# EAGLE design Dialer (EAGLE 7.2.0)
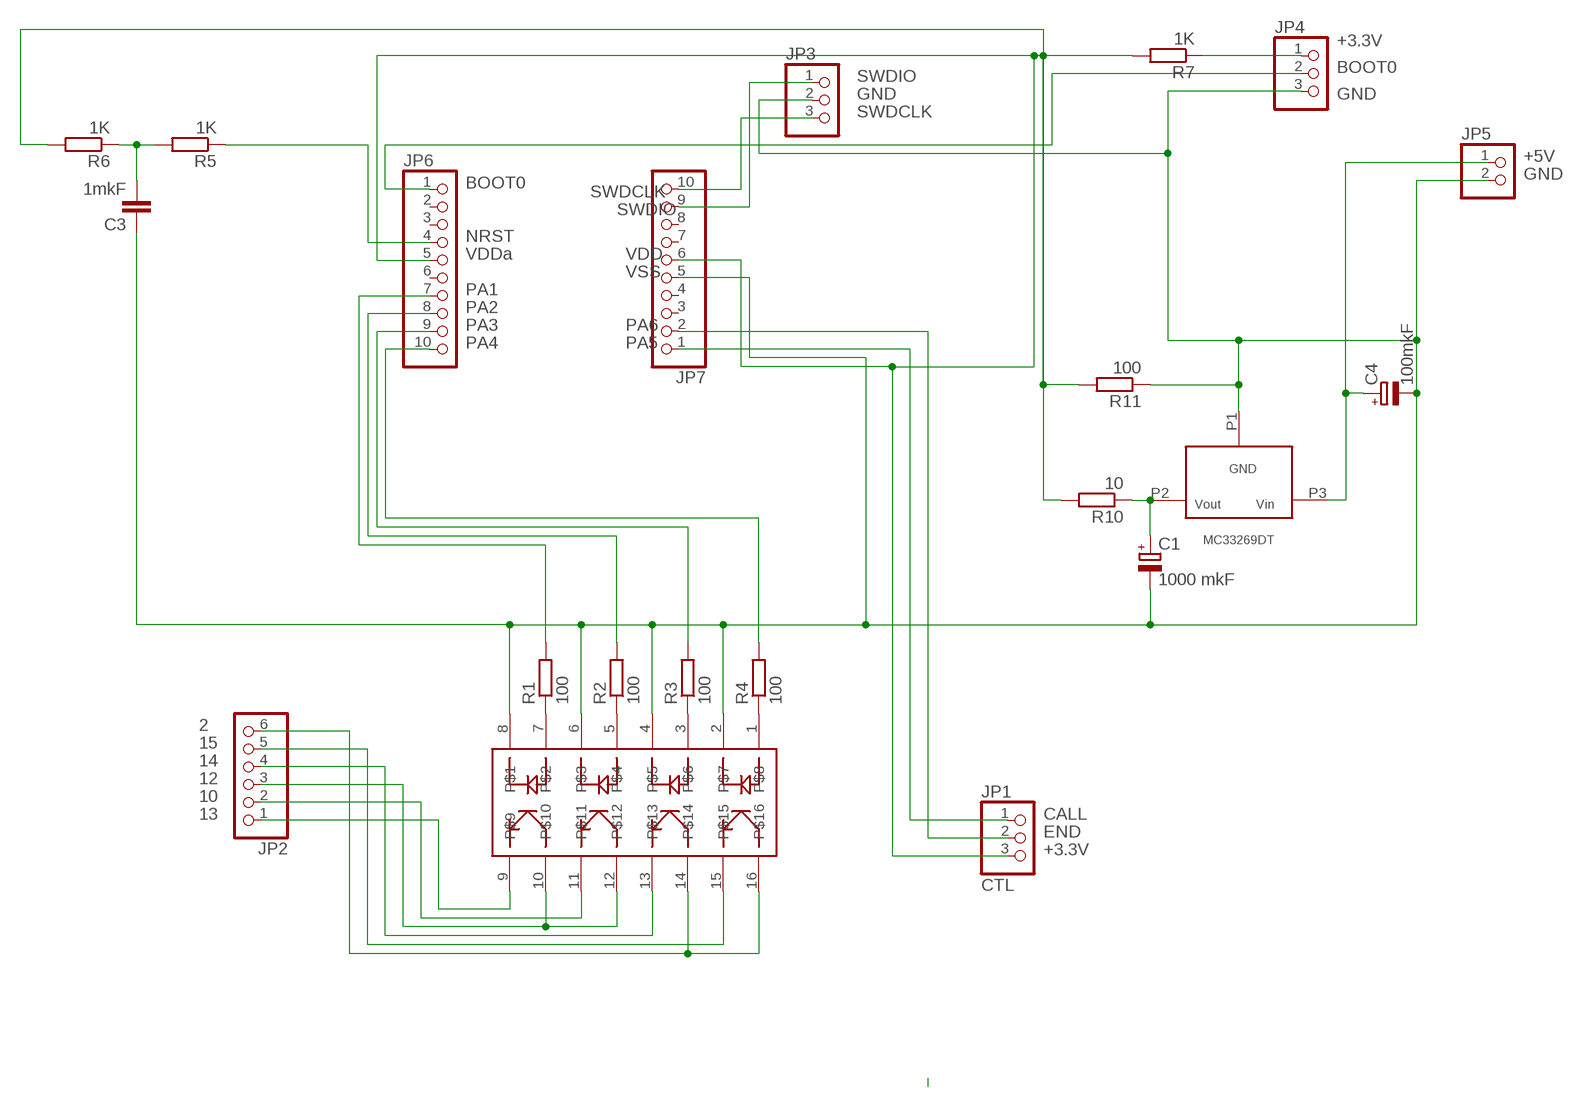
[diagram p0: schematic, sheet 1]

## Parts
C1  1000 mkF  CPOL-EUE3.5-8  [E3,5-8]
C3  1mkF  C-EUC1206  [C1206]
C4  100mkF  CPOL-EUE5-6  [E5-6]
JP1  CTL  PINHD-1X3  [1X03]
JP2  PINHD-1X6  [1X06]
JP3  PINHD-1X3  [1X03]
JP4  PINHD-1X3  [1X03]
JP5  PINHD-1X2  [1X02]
JP6  PINHD-1X10  [1X10]
JP7  PINHD-1X10  [1X10]
R1  100  R-EU_M1206  [M1206]
R2  100  R-EU_M1206  [M1206]
R3  100  R-EU_M1206  [M1206]
R4  100  R-EU_M1206  [M1206]
R5  1K  R-EU_M1206  [M1206]
R6  1K  R-EU_M1206  [M1206]
R7  1K  R-EU_M1206  [M1206]
R10  10  R-EU_M1206  [M1206]
R11  100  R-EU_M1206  [M1206]
U$1  LTV847  [DIL16]
U$3  MC33269DT  [MC33269DT]

## Nets
N$1: JP3.3 JP7.10
N$2: JP6.10 R4.2
N$3: JP6.7 R1.2
N$4: JP6.8 R2.2
N$5: JP6.9 R3.2
N$6: JP3.1 JP7.9
N$7: JP2.6 U$1.14 U$1.16
N$8: JP2.5 U$1.15
N$9: JP2.4 U$1.13
N$10: JP2.3 U$1.10 U$1.12
N$11: JP2.2 U$1.11
N$12: JP2.1 U$1.9
N$13: C1.- C3.1 C4.- JP3.2 JP4.3 JP5.2 JP7.5 R11.1 U$1.2 U$1.4 U$1.6 U$1.8 U$3.P1(GND)
N$14: C4.+ JP5.1 U$3.P3(VIN)
N$15: JP1.3 JP6.5 JP7.6 R6.2 R7.2 R10.2 R11.2
N$18: R1.1 U$1.7
N$19: R2.1 U$1.5
N$20: R3.1 U$1.3
N$21: R4.1 U$1.1
N$70: JP1.1 JP7.1
N$71: JP1.2 JP7.2
N$72: JP6.4 R5.1
N$73: C3.2 R5.2 R6.1
N$74: C1.+ R10.1 U$3.P2(VOUT)
N$75: JP4.1 R7.1
N$76: JP4.2 JP6.1
Unconnected: JP6.2 JP6.3 JP6.6 JP7.3 JP7.4 JP7.7 JP7.8

## Notes on the sheet
- +3.3V
- BOOT0
- SWDIO
- GND | GND
- SWDCLK
- +5V
- GND
- BOOT0
- SWDCLK
- SWDIO
- NRST
- VDDa | VDD
- VSS
- PA1
- PA2
- PA3 | PA6
- PA4 | PA5
- 2
- 15
- 14
- 12
- 10
- 13 | CALL
- END
- +3.3V

## Library data of the parts
C1 C4 = resistor:CPOL-EU: POLARIZED CAPACITOR, European symbol
C3 = resistor:C-EU: CAPACITOR, European symbol
JP1 JP3 JP4 = pinhead:PINHD-1X3: PIN HEADER
JP2 = pinhead:PINHD-1X6: PIN HEADER
JP5 = pinhead:PINHD-1X2: PIN HEADER
JP6 JP7 = pinhead:PINHD-1X10: PIN HEADER
R1-R7 R10 R11 = resistor:R-EU_: RESISTOR, European symbol
U$1 = optocoupler:LTV847: LTV847 4-optocoupler DIP16
U$3 = mc33269dt:MC33269DT

## Board
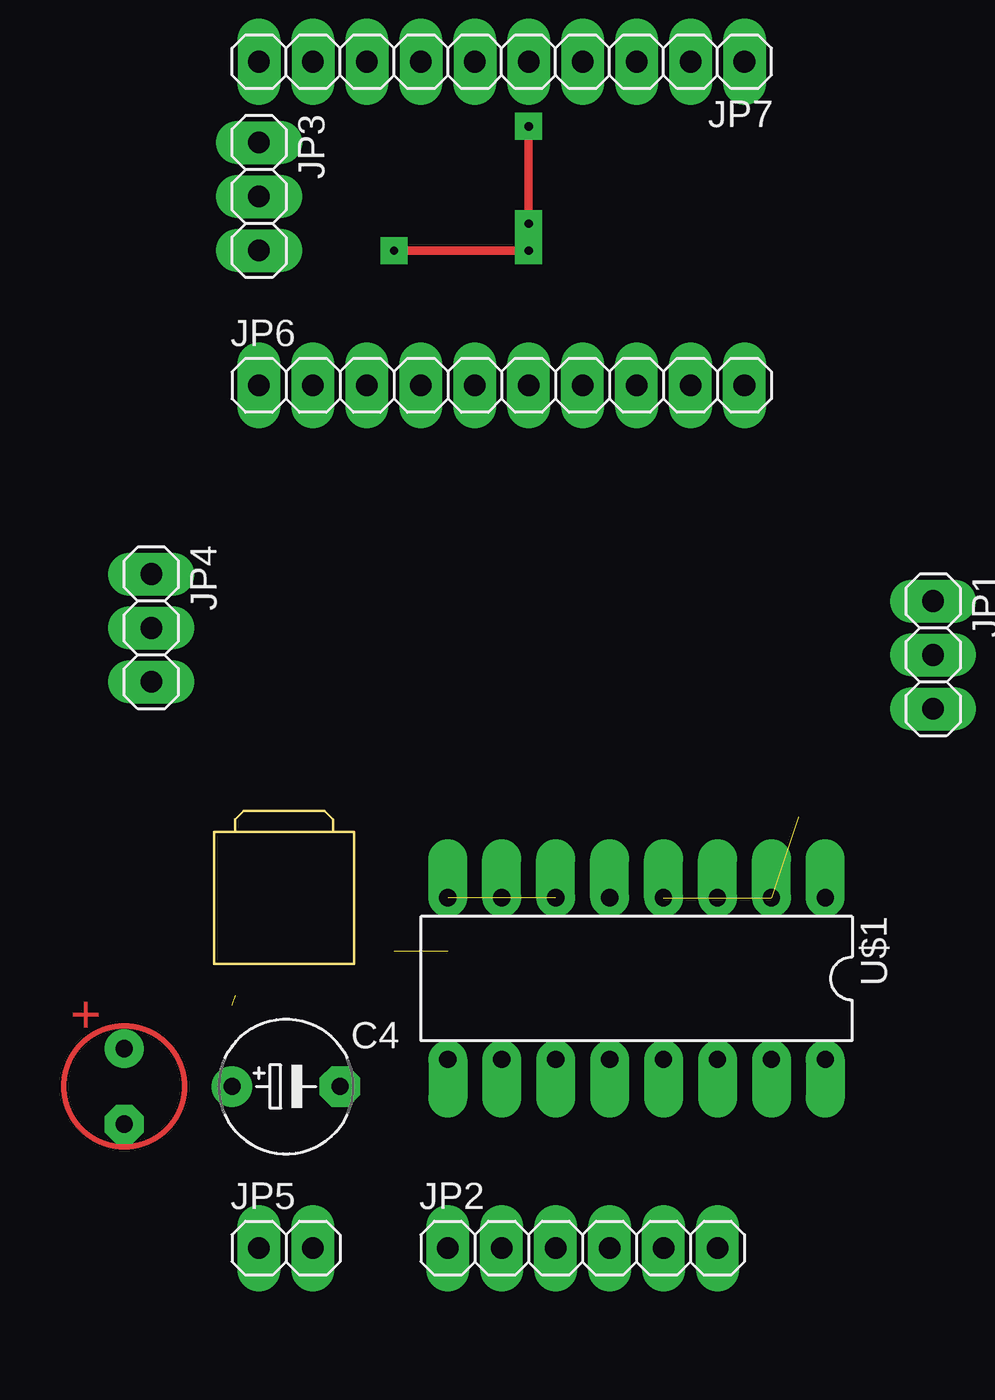
[diagram p1: board, top side]
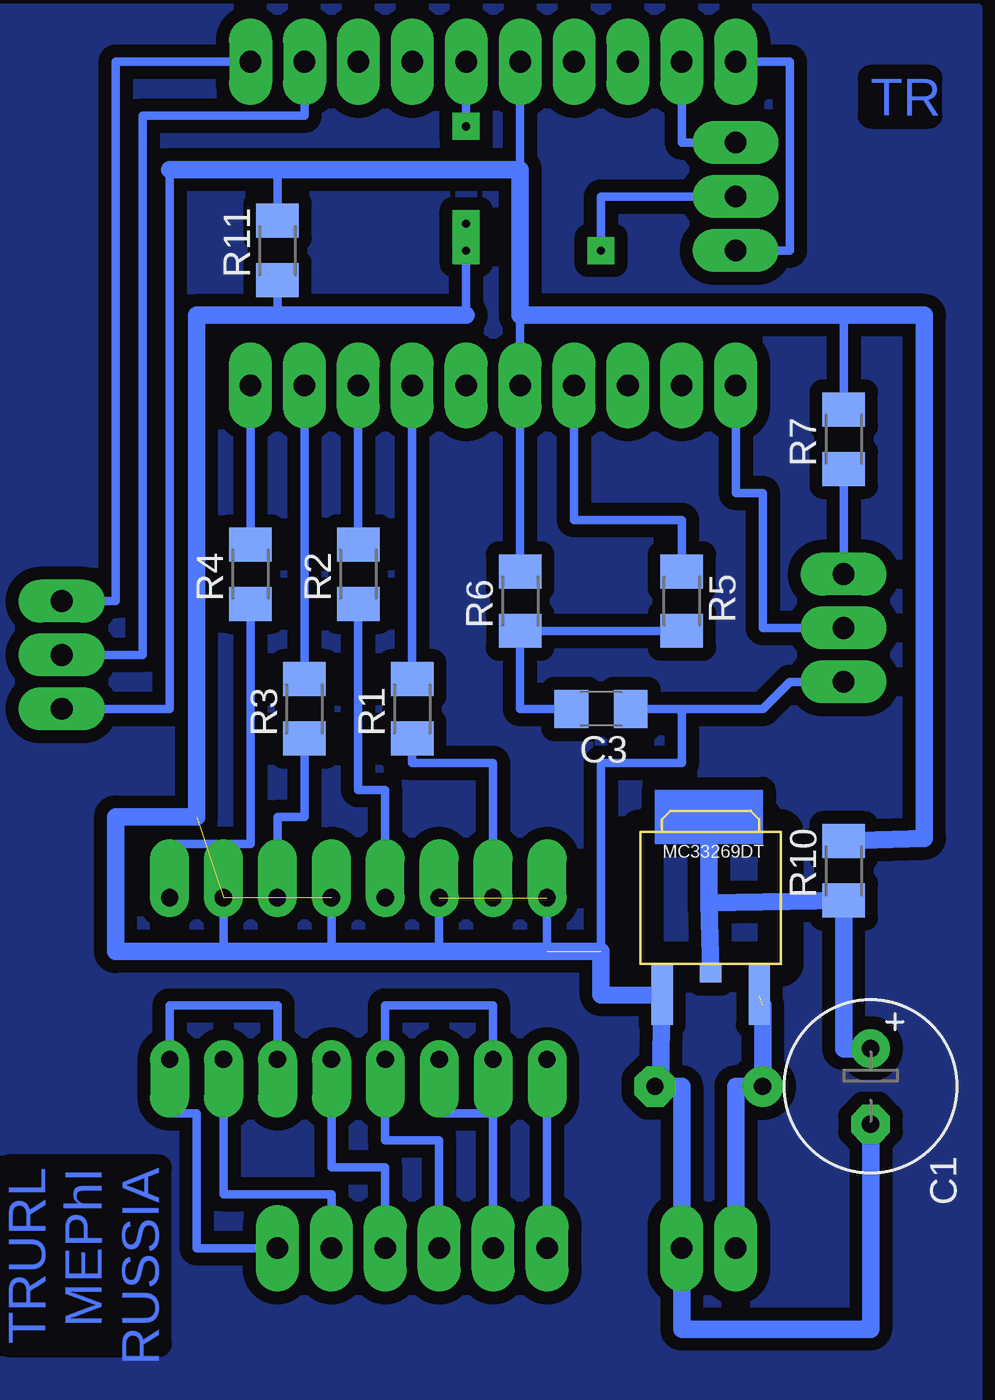
[diagram p2: board, bottom side, seen from below]

Size 6.6 x 7.2 mm. Coordinates in mm from the lower left corner, seen from the top.
Copper layers (1*16): Top 0.035mm / dielectric 1.5mm / Bottom 0.035mm
Design rules "default *": minimum track width 10mil, minimum drill 10mil, track to track 8mil, track to pad 8mil, pad to pad 8mil, via to via 8mil, smd to smd 8mil, copper to edge 40mil, drill to drill 8mil, minimum pad ring 20mil, minimum via ring 12mil, stop-mask expansion 4mil, vias tented up to drill 0mil, thermal gap 10mil

### Footprints (pad centres in the part's own frame; a part is rotated, then mirrored left to right if it is on the bottom)
E3,5-8 = drill 0.813 pad 1.6: + -1.778,0 | drill 0.813 pad 1.6 octagon: - 1.778,0
C1206 = smd 1.6 x 1.8: 1 -1.4,0; 2 1.4,0
E5-6 = drill 0.813 pad 1.905: + -2.54,0 | drill 0.813 pad 1.905 octagon: - 2.54,0
1X03 = drill 1.016 long: 1 -2.54,0; 2 0,0; 3 2.54,0
1X06 = drill 1.016 long: 1 -6.35,0; 2 -3.81,0; 3 -1.27,0; 4 1.27,0; 5 3.81,0; 6 6.35,0
1X02 = drill 1.016 long: 1 -1.27,0; 2 1.27,0
1X10 = drill 1.016 long: 1 -11.43,0; 2 -8.89,0; 3 -6.35,0; 4 -3.81,0; 5 -1.27,0; 6 1.27,0; 7 3.81,0; 8 6.35,0; 9 8.89,0; 10 11.43,0
M1206 = smd 1.6 x 2: 1 -1.4,0; 2 1.4,0
DIL16 = drill 0.813 offset: 1 -8.89,-3.81; 2 -6.35,-3.81; 3 -3.81,-3.81; 4 -1.27,-3.81; 5 1.27,-3.81; 6 3.81,-3.81; 7 6.35,-3.81; 8 8.89,-3.81; 9 8.89,3.81; 10 6.35,3.81; 11 3.81,3.81; 12 1.27,3.81; 13 -1.27,3.81; 14 -3.81,3.81; 15 -6.35,3.81; 16 -8.89,3.81
MC33269DT = smd 1 x 2.8: P1 -2.2,-4.59; P3 2.38,-4.59 | smd 1 x 0.8: P2 0.09,-3.59

### Placement (x,y rotation side)
C1  -4.23,-5.78 270 bottom  (outside the outline)
C3  8.47,12 180 bottom  (outside the outline)
C4  3.39,-5.78 0 top  (outside the outline)
JP1  33.87,14.54 270 top  (outside the outline)
JP2  17.36,-13.4 0 top  (outside the outline)
JP3  2.12,36.13 270 top  (outside the outline)
JP4  -2.96,15.81 270 top  (outside the outline)
JP5  3.39,-13.4 0 top  (outside the outline)
JP6  13.55,27.24 0 top  (outside the outline)
JP7  13.55,42.48 180 top  (outside the outline)
R1  17.36,12 90 bottom  (outside the outline)
R2  19.9,18.35 90 bottom  (outside the outline)
R3  22.44,12 90 bottom  (outside the outline)
R4  24.98,18.35 90 bottom  (outside the outline)
R5  4.66,17.08 270 bottom  (outside the outline)
R6  12.28,17.08 90 bottom  (outside the outline)
R7  -2.96,24.7 90 bottom  (outside the outline)
R10  -2.96,4.38 90 bottom
R11  23.71,33.59 90 bottom  (outside the outline)
U$1  19.9,-0.7 180 top  (outside the outline)
U$3  3.39,3.11 0 bottom

### Tracks (layer width: path | path; a pad name or v marks a point on that pad's centre or on a via)
N$1
  Bottom 0.406: JP7.10 -0.42,42.48 -0.42,33.59 JP3.3
N$2
  Bottom 0.406: JP6.10 R4.2
N$3
  Bottom 0.406: JP6.7 R1.2
N$4
  Bottom 0.406: JP6.8 R2.2
N$5
  Bottom 0.406: JP6.9 R3.2
N$6
  Bottom 0.406: JP7.9 4.66,38.67 JP3.1
N$7
  Bottom 0.406: U$1.14 23.71,-1.97 28.79,-1.97 U$1.16 28.79,-7.05 27.52,-7.05 27.52,-13.4 JP2.6
N$8
  Bottom 0.406: U$1.15 26.25,-10.86 21.17,-10.86 JP2.5
N$9
  Bottom 0.406: U$1.13 21.17,-9.59 18.63,-9.59 JP2.4
N$10
  Bottom 0.406: U$1.10 13.55,-1.97 18.63,-1.97 U$1.12 18.63,-8.32 16.09,-8.32 JP2.3
N$11
  Bottom 0.406: U$1.11 16.09,-7.05 13.55,-7.05 JP2.2
N$12
  Bottom 0.406: U$1.9 JP2.1
N$13  (via drill 0.38 pad 1.27)  (4 unrouted)
  Top 0.406: v14.82,39.43 v14.82,34.86 v14.82,33.59 v8.47,33.59
  Bottom 0.406: U$1.2 26.25,0.57 | U$1.8 11.01,0.57 | U$1.6 16.09,0.57 | U$1.4 21.17,0.57 | JP3.2 8.47,36.13 v8.47,33.59 | JP7.5 v14.82,39.43 | 14.82,30.54 v14.82,33.59 | 8.47,0.57 8.47,9.46 4.66,9.46 4.66,12 | C3.1 4.66,12 | 4.66,12 0.85,12 -0.42,13.27 JP4.3 | 23.71,31.05 R11.1 23.71,30.54
  Bottom 0.813: 14.82,30.54 23.71,30.54 27.52,30.54 27.52,6.92 31.33,6.92 31.33,0.57 8.47,0.57 8.47,-1.46 U$3.P1 5.68,-5.78 | C4.- 5.68,-5.78 | 5.68,-5.78 4.66,-5.78 JP5.2 4.66,-17.21 -4.23,-17.21 C1.-
N$14  (1 unrouted)
  Bottom 0.813: 0.85,-1.97 C4.+ 2.12,-5.78 JP5.1
N$15
  Bottom 0.406: R6.2 JP6.5 12.28,30.54 | JP7.6 12.28,37.4 | JP1.3 28.79,12 28.79,37.4 | R7.2 -2.96,30.54 | R11.2 23.71,37.4
  Bottom 0.813: R10.2 -6.77,5.9 -6.77,30.54 -2.96,30.54 12.28,30.54 12.28,37.4 23.71,37.4 28.79,37.4
N$16
  pour Bottom (isolate 0.61): -9.31,45.02 38.95,45.02 38.95,-21.02 -9.31,-21.02
N$17
  Bottom 0.813: 3.39,3.11 3.39,5.65
N$18
  Bottom 0.406: R1.1 17.36,9.46 13.55,9.46 U$1.7
N$19
  Bottom 0.406: R2.1 19.9,8.19 18.63,8.19 U$1.5
N$20
  Bottom 0.406: R3.1 22.44,6.92 23.71,6.92 U$1.3
N$21
  Bottom 0.406: R4.1 24.98,5.65 28.79,5.65 U$1.1
N$70
  Bottom 0.406: JP7.1 31.33,42.48 31.33,17.08 JP1.1
N$71
  Bottom 0.406: JP7.2 22.44,39.94 30.06,39.94 30.06,14.54 JP1.2
N$72
  Bottom 0.406: JP6.4 9.74,20.89 4.66,20.89 R5.1
N$73
  Bottom 0.406: R5.2 R6.1 12.28,12 C3.2
N$74
  Bottom 0.813: U$3.P2 3.39,2.86 R10.1 -2.96,-4 C1.+
N$75
  Bottom 0.406: R7.1 JP4.1
N$76
  Bottom 0.406: JP4.2 0.85,15.81 0.85,22.16 2.12,22.16 JP6.1
(copper drawn outside any net)
  shapes: Bottom area x1, Top circle x1

### Text on the board
Top: +
Bottom: TR | TRURL / MEPhI / RUSSIA
tOrigins: IO | SWD\ | G | CLK | 1 | 1 | CALL\ | B | END | BOOT | +3.3V | 0 | 10 | 14 | 2 | +5V | G | 13 | 12 | 15